# Altium schematic sheet RS232.SchDoc: RS232 to DB9 Interface
size B; Date: 24-02-04; CheckedBy: Jude Thibeault; Author: Kyle Dick; DrawnBy: Kyle Dick; Engineer: Kyle Dick; Organization: Conestoga College; Revision: 3; SheetNumber: 2; SheetTotal: 9
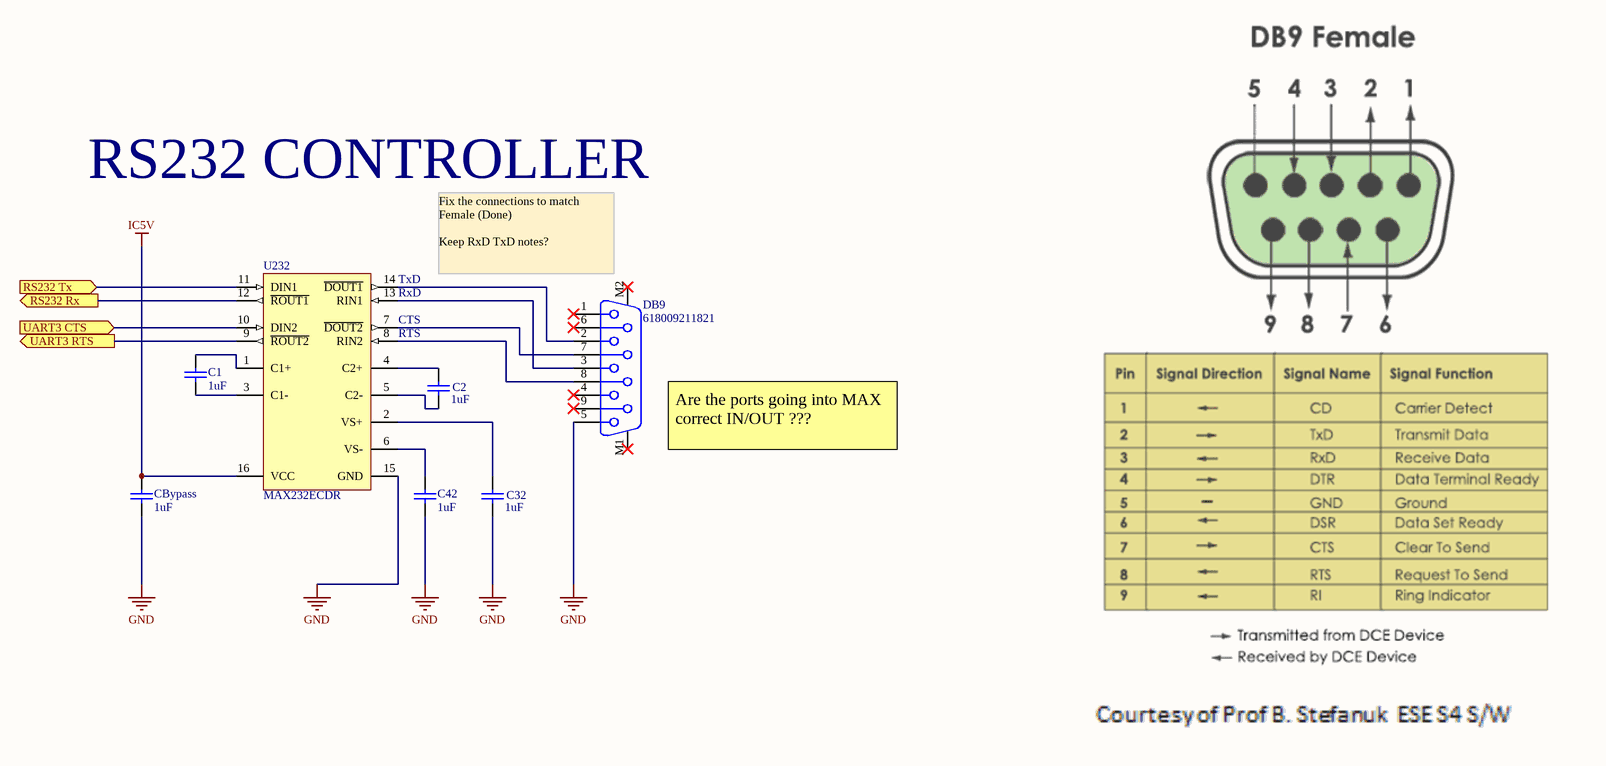
[diagram p0: RS232.SchDoc]

## Parts
C1  value 1uF  (hidden comment: Capacitor)
C2  value 1uF  (hidden comment: Capacitor)
C32  value 1uF  (hidden comment: Capacitor)
C42  value 1uF  (hidden comment: Capacitor)
CBypass  value 1uF  (hidden comment: Capacitor)
DB9  618009211821  [618009211821]
U232  MAX232ECDR  [D0016A_L]

## Ports
RS232 Rx (out, see Top Level Hierarchy[4B], MCU Header[5C]), RS232 Tx (in, see Top Level Hierarchy[4B], MCU Header[4C]), UART3 CTS (in, see Top Level Hierarchy[4B]), UART3 RTS (out, see Top Level Hierarchy[4B])

## Nets
GND: C32.1 C42.1 CBypass.1 DB9.5 U232.15(GND)
IC5V: CBypass.2 U232.16(VCC)
RS232 Rx: U232.12(~{ROUT1}) ; port RS232 Rx
RS232 Tx: U232.11(DIN1) ; port RS232 Tx
UART3 CTS: U232.10(DIN2) ; port UART3 CTS
UART3 RTS: U232.9(~{ROUT2}) ; port UART3 RTS
NetC1_1: C1.1 U232.3(C1-)
NetC1_2: C1.2 U232.1(C1+)
NetC2_1: C2.1 U232.5(C2-)
NetC2_2: C2.2 U232.4(C2+)
NetC32_2: C32.2 U232.2(VS+)
NetC42_2: C42.2 U232.6(VS-)
NetDB9_2: DB9.2 U232.14(~{DOUT1})
NetDB9_3: DB9.3 U232.13(RIN1)
NetDB9_7: DB9.7 U232.7(~{DOUT2})
NetDB9_8: DB9.8 U232.8(RIN2)

Not connected (* = marked no-connect by the designer): DB9 1* 4* 6* 9* M1* M2*

## Notes on the sheet
- RS232 CONTROLLER
- (near U232) RxD
- (near U232) TxD
- (near DB9) Fix the connections to match Female (Done)
  Keep RxD TxD notes?
- (near U232) CTS
- (near U232) RTS
- (near DB9) Are the ports going into MAX correct IN/OUT ???
- ESE
- is the sole property of ESE. Any reproduction
- The Information Contained in this drawing
- Schematic P/N and Name
- Sheet Name
- 850 Fountain St. S.
- Cambridge, ON N3H 0A8
- Canada
- Approved
- in part or in whole without the written
- permission of ESE is strictly prohibited.
- APPROVALS
- DATE
- Size
- Scale
- B
- NTS
- Bare PCB P/N
- Date
- Sheet
- Rev.
- Checked
- Created
- of

## Library data of the parts
C1 C2 C32 C42 CBypass = Capacitor: SimulationGenericComponent: True
DB9 = CMP-1502-00208-2: NexarPartId: 89205517; Insulation Resistance: 5GΩ; Current Rating: 3A; Contact Resistance: 30mΩ; Gender: Female; Operating Supply Voltage: 125V; Pitch: 2.77mm; Insulation Material: PBT; Contact Plating: Gold; Number of Pins: 9; RoHS: Compliant; Max Operating Temperature: 105°C; Length: 16.33mm; Min Operating Temperature: -55°C
U232 = CMP-0299-00610-2: Dual RS-232 Driver / Receiver with IEC61000-4-2 Protection, 0 to 70 degC, 16-Pin SOIC (D), Green (RoHS & no Sb/Br); IEC-61000-4-2 SUPPORT: TRUE; Supply Voltage(s)(V): 5; Receivers Per Package: 2; ESD HBM(kV): +/-15; ICC(Max)(mA): 10; ComponentLink3Description: Package Specification; PackageReference: D0016A; PackageVersion: revM, Jun-2011; ComponentLink2Description: Datasheet; PackageDescription: 16-Pin Plastic Small Outline Integrated Circuit, 9.9 x 3.9 mm, Pitch 1.27 mm Pitch; ComponentLink3URL: http://www.ti.com/litv/pdf/mpds178g; ComponentLink1Description: Manufacturer URL; Drivers Per Package: 2; DatasheetVersion: SLLS723B; ComponentLink2URL: http://www.ti.com/general/docs/lit/getliterature.tsp?genericPartNumber=MAX232E&fileType=pdf; RS-232: TRUE; SubFamily: RS-232; ComponentLink1URL: www.ti.com; Single Supply: TRUE